# Altium project MAX20801EVBCir_1.PrjPcb
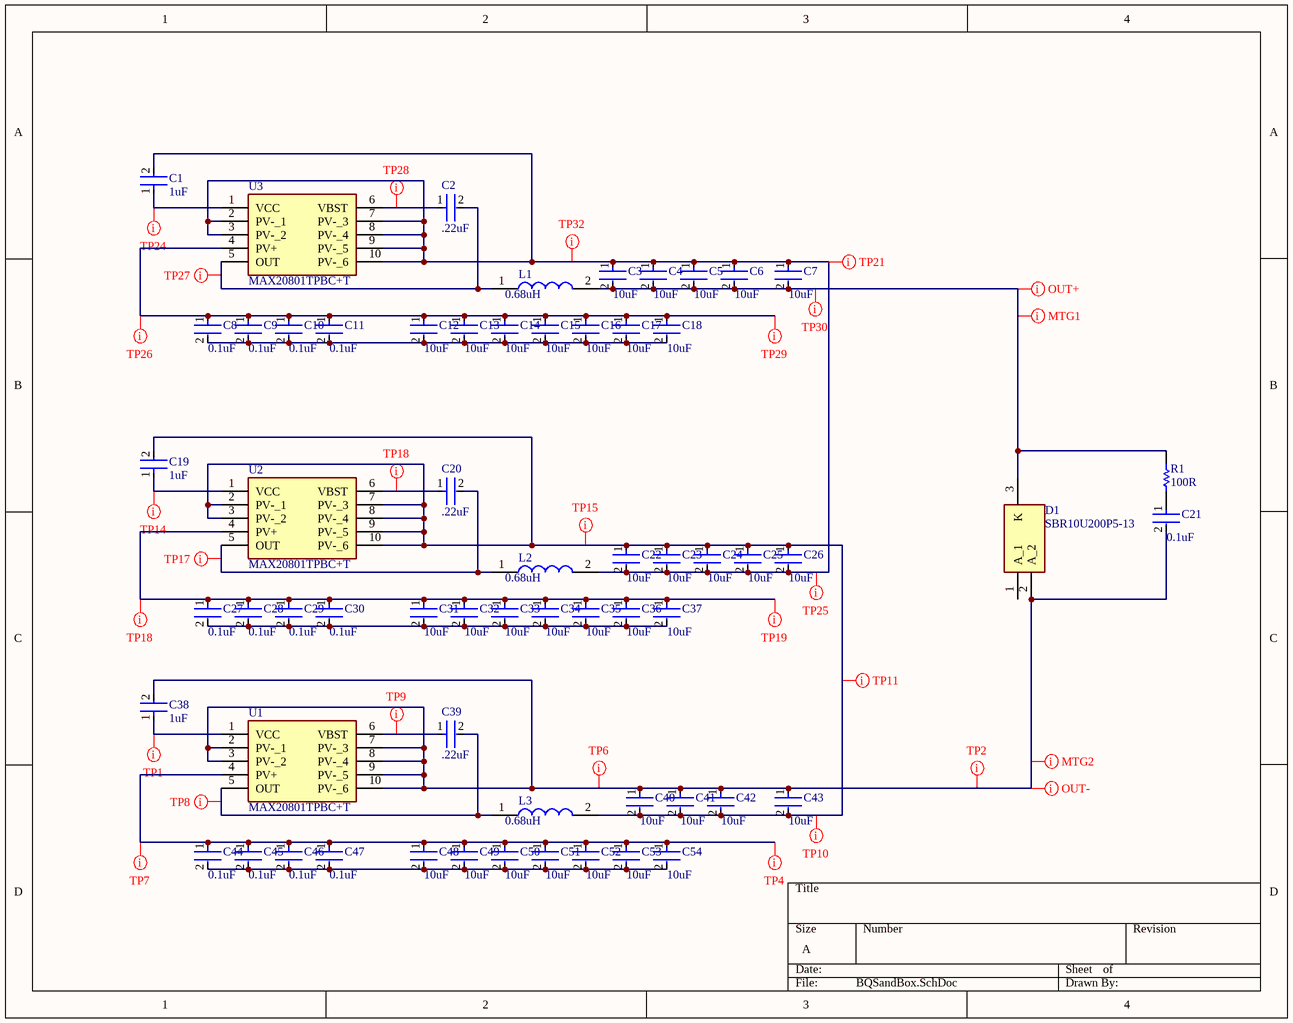
[diagram p0: BQSandBox.SchDoc]
1 sheet, 62 parts. Net scope: global (net labels, ports and power ports of the same name join across sheets).

## Sheet BQSandBox.SchDoc
size A; SheetNumber: 1; SheetTotal: 1

### Parts
C1  1uF  [FP-C0805C-DN-IPC_A]
C2  .22uF  [FP-C0805C-DN-MFG]
C3  10uF  [FP-C0805C-DN-IPC_A]
C4  10uF  [FP-C0805C-DN-IPC_A]
C5  10uF  [FP-C0805C-DN-IPC_A]
C6  10uF  [FP-C0805C-DN-IPC_A]
C7  10uF  [FP-C0805C-DN-IPC_A]
C8  0.1uF  [FP-C0805C-DN-IPC_A]
C9  0.1uF  [FP-C0805C-DN-IPC_A]
C10  0.1uF  [FP-C0805C-DN-IPC_A]
C11  0.1uF  [FP-C0805C-DN-IPC_A]
C12  10uF  [FP-C0805C-DN-IPC_A]
C13  10uF  [FP-C0805C-DN-IPC_A]
C14  10uF  [FP-C0805C-DN-IPC_A]
C15  10uF  [FP-C0805C-DN-IPC_A]
C16  10uF  [FP-C0805C-DN-IPC_A]
C17  10uF  [FP-C0805C-DN-IPC_A]
C18  10uF  [FP-C0805C-DN-IPC_A]
C19  1uF  [FP-C0805C-DN-IPC_A]
C20  .22uF  [FP-C0805C-DN-MFG]
C21  0.1uF  [FP-C0805C-DN-IPC_A]
C22  10uF  [FP-C0805C-DN-IPC_A]
C23  10uF  [FP-C0805C-DN-IPC_A]
C24  10uF  [FP-C0805C-DN-IPC_A]
C25  10uF  [FP-C0805C-DN-IPC_A]
C26  10uF  [FP-C0805C-DN-IPC_A]
C27  0.1uF  [FP-C0805C-DN-IPC_A]
C28  0.1uF  [FP-C0805C-DN-IPC_A]
C29  0.1uF  [FP-C0805C-DN-IPC_A]
C30  0.1uF  [FP-C0805C-DN-IPC_A]
C31  10uF  [FP-C0805C-DN-IPC_A]
C32  10uF  [FP-C0805C-DN-IPC_A]
C33  10uF  [FP-C0805C-DN-IPC_A]
C34  10uF  [FP-C0805C-DN-IPC_A]
C35  10uF  [FP-C0805C-DN-IPC_A]
C36  10uF  [FP-C0805C-DN-IPC_A]
C37  10uF  [FP-C0805C-DN-IPC_A]
C38  1uF  [FP-C0805C-DN-IPC_A]
C39  .22uF  [FP-C0805C-DN-MFG]
C40  10uF  [FP-C0805C-DN-IPC_A]
C41  10uF  [FP-C0805C-DN-IPC_A]
C42  10uF  [FP-C0805C-DN-IPC_A]
C43  10uF  [FP-C0805C-DN-IPC_A]
C44  0.1uF  [FP-C0805C-DN-IPC_A]
C45  0.1uF  [FP-C0805C-DN-IPC_A]
C46  0.1uF  [FP-C0805C-DN-IPC_A]
C47  0.1uF  [FP-C0805C-DN-IPC_A]
C48  10uF  [FP-C0805C-DN-IPC_A]
C49  10uF  [FP-C0805C-DN-IPC_A]
C50  10uF  [FP-C0805C-DN-IPC_A]
C51  10uF  [FP-C0805C-DN-IPC_A]
C52  10uF  [FP-C0805C-DN-IPC_A]
C53  10uF  [FP-C0805C-DN-IPC_A]
C54  10uF  [FP-C0805C-DN-IPC_A]
D1  SBR10U200P5-13  [SBR10U200P513]
L1  0.68uH  [INDPM6965X300N]
L2  0.68uH  [INDPM6965X300N]
L3  0.68uH  [INDPM6965X300N]
R1  100R  [FP-C0805C-DN-IPC_A]
U1  MAX20801TPBC+T  [MAX20801TPBC]
U2  MAX20801TPBC+T  [MAX20801TPBC]
U3  MAX20801TPBC+T  [MAX20801TPBC]

### Nets
NetC1_1: C1.1 U3.1(VCC)
NetC1_2: C1.2 C3.1 C4.1 C5.1 C6.1 C7.1 C22.2 C23.2 C24.2 C25.2 C26.2 L2.2 U3.2(PV-_1) U3.3(PV-_2) U3.7(PV-_3) U3.8(PV-_4) U3.9(PV-_5) U3.10(PV-_6)
NetC2_1: C2.1 U3.6(VBST)
NetC2_2: C2.2 L1.1 U3.5(OUT)
NetC3_2: C3.2 C4.2 C5.2 C6.2 C7.2 D1.3(K) L1.2 R1.2
NetC8_1: C8.1 C9.1 C10.1 C11.1 C12.1 C13.1 C14.1 C15.1 C16.1 C17.1 C18.1 U3.4(PV+)
NetC8_2: C8.2 C9.2 C10.2 C11.2 C12.2 C13.2 C14.2 C15.2 C16.2 C17.2 C18.2
NetC19_1: C19.1 U2.1(VCC)
NetC19_2: C19.2 C22.1 C23.1 C24.1 C25.1 C26.1 C40.2 C41.2 C42.2 C43.2 L3.2 U2.2(PV-_1) U2.3(PV-_2) U2.7(PV-_3) U2.8(PV-_4) U2.9(PV-_5) U2.10(PV-_6)
NetC20_1: C20.1 U2.6(VBST)
NetC20_2: C20.2 L2.1 U2.5(OUT)
NetC21_1: C21.1 R1.1
NetC21_2: C21.2 C38.2 C40.1 C41.1 C42.1 C43.1 D1.2(A_2) U1.2(PV-_1) U1.3(PV-_2) U1.7(PV-_3) U1.8(PV-_4) U1.9(PV-_5) U1.10(PV-_6)
NetC27_1: C27.1 C28.1 C29.1 C30.1 C31.1 C32.1 C33.1 C34.1 C35.1 C36.1 C37.1 U2.4(PV+)
NetC27_2: C27.2 C28.2 C29.2 C30.2 C31.2 C32.2 C33.2 C34.2 C35.2 C36.2 C37.2
NetC38_1: C38.1 U1.1(VCC)
NetC39_1: C39.1 U1.6(VBST)
NetC39_2: C39.2 L3.1 U1.5(OUT)
NetC44_1: C44.1 C45.1 C46.1 C47.1 C48.1 C49.1 C50.1 C51.1 C52.1 C53.1 C54.1 U1.4(PV+)
NetC44_2: C44.2 C45.2 C46.2 C47.2 C48.2 C49.2 C50.2 C51.2 C52.2 C53.2 C54.2

Not connected (* = marked no-connect by the designer): D1 1(A_1)

### Layout directives
mark named TP4: NetC44_1
mark named TP1: NetC38_1
mark named TP8: NetC39_2
mark named TP7: NetC44_1
mark named TP10: NetC19_2
mark named TP11: NetC19_2
mark named TP2: NetC21_2
mark named OUT-: NetC21_2
mark named MTG2: NetC21_2
mark named TP6: NetC21_2
mark named TP9: NetC39_1
mark named TP19: NetC27_1
mark named TP14: NetC19_1
mark named TP17: NetC20_2
mark named TP18: NetC20_1, NetC27_1
mark named TP25: NetC1_2
mark named TP15: NetC19_2
mark named TP29: NetC8_1
mark named TP24: NetC1_1
mark named TP27: NetC2_2
mark named TP26: NetC8_1
mark named TP30: NetC3_2
mark named TP32: NetC1_2
mark named TP28: NetC2_1
mark named OUT+: NetC3_2
mark named MTG1: NetC3_2
mark named TP21: NetC1_2

### Library data of the parts
C1 C19 C38 = C0805C105K4PACTU: Cap Ceramic 1uF 16V X5R 10% SMD 0805 85C Plastic T/R; Manufacturer: KEMET; Dissipation Factor: 5%; Supplier 1: Digi-Key; Manufacturer Part Number: C0805C105K4PACTU; RoHS: Yes; Category: Ceramic Capacitors; Pricing 1: 1=0.20000, 10=0.13400, 50=0.08060, 100=0.06810, 500=0.04662, 1000=0.04124 (USD); Mount: Surface Mount,PCB; Case/Package: 0805; Case Code (Metric): 2012; Case Code (Imperial): 0805; Dielectric Material: Ceramic; Min Operating Temperature: -55°C; Max Operating Temperature: 85°C; Capacitance: 1uF; Tolerance: 10%; Packaging: Tape and Reel; Voltage Rating: 16V; Package Quantity: 1; Voltage Rating (DC): 16V; Dielectric: X5R; Termination: SMD/SMT; Voltage: 16V; Series: C0805C; Construction: Flat; Length: 2mm; Width: 0.049inch; Height: 1.25mm; Thickness: 0.055inch; Depth: 1.25mm; Radiation Hardening: No; REACH SVHC: No SVHC; RoHS Compliant: Yes; Lead Free: Lead Free; ComponentLink1URL: http://www.farnell.com/datasheets/2745930.pdf?src-supplier=Farnell; ComponentLink1Description: http://www.farnell.com/datasheets/2745930.pdf?src-supplier=Farnell; ComponentLink2URL: http://uk.rs-online.com/webdocs/13da/0900766b813daa10.pdf?src-supplier=RSComponents; ComponentLink2Description: http://uk.rs-online.com/webdocs/13da/0900766b813daa10.pdf?src-supplier=RSComponents; ComponentLink3URL: http://components.arrow.com/part/dataview/43037300S8313636N7429?src-supplier=Arrow+Electronics; ComponentLink3Description: http://components.arrow.com/part/dataview/43037300S8313636N7429?src-supplier=Arrow+Electronics; ComponentLink4URL: http://uk.rs-online.com/webdocs/13da/0900766b813daa0f.pdf?src-supplier=RSComponents; ComponentLink4Description: http://uk.rs-online.com/webdocs/13da/0900766b813daa0f.pdf?src-supplier=RSComponents; ComponentLink5URL: https://search.kemet.com/component-edge/download/datasheet/C0805C105K4PAC.pdf?src-supplier=Avnet; ComponentLink5Description: https://search.kemet.com/component-edge/download/datasheet/C0805C105K4PAC.pdf?src-supplier=Avnet; ComponentLink6URL: http://www.farnell.com/datasheets/2745930.pdf?src-supplier=Newark; ComponentLink6Description: http://www.farnell.com/datasheets/2745930.pdf?src-supplier=Newark; ComponentLink7URL: https://search.kemet.com/component-edge/download/datasheet/C0805C105K4PAC.pdf?src-supplier=Allied+Electronics; ComponentLink7Description: https://search.kemet.com/component-edge/download/datasheet/C0805C105K4PAC.pdf?src-supplier=Allied+Electronics; ComponentLink8URL: http://www.farnell.com/datasheets/2745930.pdf?src-supplier=Element14; ComponentLink8Description: http://www.farnell.com/datasheets/2745930.pdf?src-supplier=Element14; ComponentLink9URL: https://www.verical.com/server-webapp/html/getDatasheet?partID=127986&src-supplier=Verical; ComponentLink9Description: https://www.verical.com/server-webapp/html/getDatasheet?partID=127986&src-supplier=Verical; ComponentLink10URL: http://www.farnell.com/datasheets/1824493.pdf?src-supplier=Newark; ComponentLink10Description: http://www.farnell.com/datasheets/1824493.pdf?src-supplier=Newark; ComponentLink11URL: http://www.kemet.com/Lists/ProductCatalog/Attachments/19/KEM_C1006_X5R_SMD.pdf?src-supplier=Avnet; ComponentLink11Description: http://www.kemet.com/Lists/ProductCatalog/Attachments/19/KEM_C1006_X5R_SMD.pdf?src-supplier=Avnet; ComponentLink12URL: https://search.kemet.com/component-edge/download/datasheet/C0805C105K4PAC.pdf?src-supplier=Mouser; ComponentLink12Description: https://search.kemet.com/component-edge/download/datasheet/C0805C105K4PAC.pdf?src-supplier=Mouser; ComponentLink13URL: https://api.kemet.com/component-edge/download/datasheet/C0805C105K4PAC.pdf?src-supplier=Digi-Key; ComponentLink13Description: https://api.kemet.com/component-edge/download/datasheet/C0805C105K4PAC.pdf?src-supplier=Digi-Key; ComponentLink14URL: https://search.kemet.com/component-edge/download/datasheet/C0805C105K4PAC.pdf?src-supplier=TTI; ComponentLink14Description: https://search.kemet.com/component-edge/download/datasheet/C0805C105K4PAC.pdf?src-supplier=TTI; Supplier Part Number 1: 399-C0805C105K4PAC7800CT-ND; Stock 1: 112717
C2 C20 C39 = CMP-1036-04552-2: CAP CER 0.22UF 50V X7R 0805; Manufacturer: KEMET; Manufacturer Part Number: C0805C224K5RACTU; Value: 0.22 μF; Description: C0805 0.22 μF X7R 30ppm/°C 10.00% 50 V; Temperature Coefficient: 30ppm/°C; Material: Ceramic; Tolerance: 0.1; ComponentLink2URL: https://content.kemet.com/datasheets/KEM_C1003_C0G_SMD.pdf; Temperature Characteristic: X7R; Device Class L3: Ceramic Capacitors; Lead Free: Yes; Temperature: -55°C to +125°C; RoHS: TRUE; Capacitance: 0.22 μF; Automotive: No; Octopart: https://octopart.com/c0805c224k5ractu-kemet-144670; Temperature Range Low: -55°C; Height: 0.88mm; Device Class L1: Passive Components; Digikey Description: CAP CER 0.22UF 50V X7R 0805; ComponentLink2Description: Datasheet; Mouser Description: CAP CER 0.22UF 50V X7R 0805; Category: Cap; Ipc Land Pattern Name: CAPC200125X78; Temperature Range High: +125°C; Package: C0805C-DN; Device Class L2: Capacitors; Voltage Rating: 50 V
C3-C7 C12-C18 C22-C26 C31-C37 C40-C43 C48-C54 = GRM21BR61C106KE15L: 贴片电容（MLCC） 10μF ±10% 16V X5R 0805; Manufacturer: Murata; Material: Ceramic; Supplier 1: Digi-Key; Manufacturer Part Number: GRM21BR61C106KE15L; RoHS: Yes; Category: Ceramic Capacitors; Pricing 1: 1=0.18000, 10=0.12400, 50=0.07420, 100=0.06270, 500=0.04292, 1000=0.03798 (USD); Mount: Surface Mount; Case/Package: 0805; Case Code (Imperial): 0805; Case Code (Metric): 2012; Min Operating Temperature: -55°C; Max Operating Temperature: 85°C; Packaging: Tape and Reel; Capacitance: 10uF; Tolerance: 10%; Voltage Rating: 16V; Voltage Rating (DC): 16V; Package Quantity: 1; Dielectric: X5R; Termination: SMD/SMT; Voltage: 16V; Series: GRM; Construction: Flat; Length: 2mm; Width: 1.25mm; Height: 1.25mm; Thickness: 0.053inch; Depth: 1.25mm; Radiation Hardening: No; REACH SVHC: No SVHC; RoHS Compliant: Yes; Lead Free: Lead Free; ComponentLink1URL: https://datasheet.ciiva.com/7719/1747468-7719090.pdf?src-supplier=Element14; ComponentLink1Description: https://datasheet.ciiva.com/7719/1747468-7719090.pdf?src-supplier=Element14; ComponentLink2URL: https://datasheet.ciiva.com/23628/460993-23628598.pdf?src-supplier=Newark; ComponentLink2Description: https://datasheet.ciiva.com/23628/460993-23628598.pdf?src-supplier=Newark; ComponentLink3URL: https://datasheet.ciiva.com/2989/product-2989696.pdf?src-supplier=Avnet; ComponentLink3Description: https://datasheet.ciiva.com/2989/product-2989696.pdf?src-supplier=Avnet; ComponentLink4URL: https://datasheet.ciiva.com/3777/1956grm21br61c106ke1523-3777137.pdf?src-supplier=Arrow+Electronics; ComponentLink4Description: https://datasheet.ciiva.com/3777/1956grm21br61c106ke1523-3777137.pdf?src-supplier=Arrow+Electronics; ComponentLink5URL: https://datasheet.ciiva.com/29202/450891-da-01-de-vs-chip-kond-0805-10-0-uf-10pr-16-0v-x5r-29202696.pdf?src-supplier=Conrad; ComponentLink5Description: https://datasheet.ciiva.com/29202/450891-da-01-de-vs-chip-kond-0805-10-0-uf-10pr-16-0v-x5r-29202696.pdf?src-supplier=Conrad; ComponentLink6URL: https://datasheet.ciiva.com/29199/454607-da-01-en-vs-kondensator-0805-29199611.pdf?src-supplier=Conrad; ComponentLink6Description: https://datasheet.ciiva.com/29199/454607-da-01-en-vs-kondensator-0805-29199611.pdf?src-supplier=Conrad; ComponentLink7URL: https://datasheet.ciiva.com/137/partnumbering-e-01-137918.pdf?src-supplier=Digi-Key; ComponentLink7Description: https://datasheet.ciiva.com/137/partnumbering-e-01-137918.pdf?src-supplier=Digi-Key; ComponentLink8URL: https://datasheet.ciiva.com/137/partnumbering-e-01-137917.pdf?src-supplier=Digi-Key; ComponentLink8Description: https://datasheet.ciiva.com/137/partnumbering-e-01-137917.pdf?src-supplier=Digi-Key; ComponentLink9URL: https://datasheet.ciiva.com/137/partnumbering-e-01-137919.pdf?src-supplier=Digi-Key; ComponentLink9Description: https://datasheet.ciiva.com/137/partnumbering-e-01-137919.pdf?src-supplier=Digi-Key; ComponentLink10URL: https://datasheet.ciiva.com/2989/product-2989697.pdf?src-supplier=Avnet; ComponentLink10Description: https://datasheet.ciiva.com/2989/product-2989697.pdf?src-supplier=Avnet; Supplier Part Number 1: 490-3886-1-ND; Stock 1: 9508002
C8-C11 C21 C27-C30 C44-C47 = C0805C104K5RACTU: Cap Ceramic 0.1uF 50V X7R 10% SMD 2.0 x 1.2 mm 125 C Paper T/R; Manufacturer: KEMET; Capacitance: 100nF; Voltage: 500V; Supplier 1: Digi-Key; Manufacturer Part Number: C0805C104K5RACTU; RoHS: Yes; Category: Ceramic Capacitors; Pricing 1: 1=0.15000, 10=0.10500, 50=0.05960, 100=0.04940, 500=0.03466, 1000=0.02869 (USD); Mount: Surface Mount,PCB; Case/Package: 0805; Number of Pins: 2; Case Code (Imperial): 0805; Case Code (Metric): 2012; Dielectric Material: Ceramic; Contact Plating: Tin,Matte; Min Operating Temperature: -55°C; Max Operating Temperature: 125°C; Package Quantity: 4000; Voltage Rating: 50V; Tolerance: 10%; Packaging: Tape and Reel; Dielectric: X7R; Termination: SMD/SMT; Voltage Rating (DC): 50V; Series: C0805C; Construction: Flat; Length: 2mm; Width: 1.2mm; Height: 0.9mm; Thickness: 0.035inch; Depth: 1.25mm; Lead Pitch: 0.75mm; Radiation Hardening: No; REACH SVHC: No SVHC; RoHS Compliant: Yes; ComponentLink1URL: https://www.distrelec.biz/Web/Downloads/_t/ds/KEM_C1002_X7R_SMD_eng_tds.pdf?mime=application%2Fpdf&src-supplier=Distrelec; ComponentLink1Description: https://www.distrelec.biz/Web/Downloads/_t/ds/KEM_C1002_X7R_SMD_eng_tds.pdf?mime=application%2Fpdf&src-supplier=Distrelec; ComponentLink2URL: http://www.farnell.com/datasheets/2740684.pdf?src-supplier=Farnell; ComponentLink2Description: http://www.farnell.com/datasheets/2740684.pdf?src-supplier=Farnell; ComponentLink3URL: http://www.farnell.com/datasheets/2740684.pdf?src-supplier=Element14; ComponentLink3Description: http://www.farnell.com/datasheets/2740684.pdf?src-supplier=Element14; Supplier Part Number 1: 399-C0805C104K5RAC7800CT-ND; Stock 1: 2034176
D1 = SBR10U200P5-13: Diode; Manufacturer_Name: Diodes Inc.; Datasheet Link: https://www.diodes.com/assets/Datasheets/SBR10U200P5.pdf; Height: 1.15mm; Manufacturer_Part_Number: SBR10U200P5-13
L1-L3 = IHLP2525CZERR47M01: Inductor; Manufacturer_Name: Vishay; Datasheet Link: https://componentsearchengine.com/Datasheets/2/IHLP2525CZERR47M01.pdf; Height: 3mm; Manufacturer_Part_Number: IHLP2525CZERR47M01; Mouser Part Number: 70-IHLP2525CZERR47M1; Mouser Price/Stock: https://www.mouser.co.uk/ProductDetail/Vishay-Dale/IHLP2525CZERR47M01?qs=%2F2dL3%2Fmkwc7l69kmHwb0VQ%3D%3D; Arrow Part Number: IHLP2525CZERR47M01; Arrow Price/Stock: https://www.arrow.com/en/products/ihlp2525czerr47m01/vishay?region=nac
R1 = ERJ-6ENF1000V: 贴片电阻 100Ω ±1% 1/8W ±100ppm/℃ 0805; Manufacturer: Panasonic; Temperature Coefficient: 100ppm/°C; Max Power Dissipation: 125mW; Voltage Rating: 150V; Supplier 1: Digi-Key; Manufacturer Part Number: ERJ-6ENF1000V; RoHS: Yes; Category: Chip SMD Resistors; Mount: Surface Mount; Case/Package: 0805; Number of Pins: 2; Case Code (Imperial): 0805; Case Code (Metric): 2012; Contact Plating: Tin; Size Code: 0805; Min Operating Temperature: -55°C; Max Operating Temperature: 155°C; Packaging: Tape and Reel; Resistance: 100R; Tolerance: 1%; Resistor Type: Thick Film; Number of Terminations: 2; Series: ERJ; Package Quantity: 1; Features: Automotive AEC-Q200; Termination: SMD/SMT; Construction: Rectangular; Power Rating: 125mW; Voltage Rating (DC): 150V; Resistance Tolerance: 1%; Technology: THICK FILM; Length: 2mm; Width: 1.2mm; Height: 0.6mm; Depth: 1.25mm; Radiation Hardening: No; RoHS Compliant: Yes; Military Standard: Not; Lead Free: Lead Free; REACH SVHC: No SVHC; ComponentLink1URL: https://datasheet.ciiva.com/11808/0900766b80f80784-11808206.pdf?src-supplier=RSComponents; ComponentLink1Description: https://datasheet.ciiva.com/11808/0900766b80f80784-11808206.pdf?src-supplier=RSComponents; ComponentLink2URL: https://datasheet.ciiva.com/7830/426256-7830744.pdf?src-supplier=Element14; ComponentLink2Description: https://datasheet.ciiva.com/7830/426256-7830744.pdf?src-supplier=Element14; ComponentLink3URL: https://datasheet.ciiva.com/7830/1678782-7830986.pdf?src-supplier=Element14; ComponentLink3Description: https://datasheet.ciiva.com/7830/1678782-7830986.pdf?src-supplier=Element14; ComponentLink4URL: https://datasheet.ciiva.com/46419/1678782-46419878.pdf?src-supplier=Element14; ComponentLink4Description: https://datasheet.ciiva.com/46419/1678782-46419878.pdf?src-supplier=Element14; ComponentLink5URL: https://datasheet.ciiva.com/16765/70260748-16765594.pdf?src-supplier=Allied+Electronics; ComponentLink5Description: https://datasheet.ciiva.com/16765/70260748-16765594.pdf?src-supplier=Allied+Electronics; ComponentLink6URL: https://datasheet.ciiva.com/9186/aoa0000ce2-9186686.pdf?src-supplier=Avnet; ComponentLink6Description: https://datasheet.ciiva.com/9186/aoa0000ce2-9186686.pdf?src-supplier=Avnet; ComponentLink7URL: https://datasheet.ciiva.com/30154/aoa0000ce2-30154938.pdf?src-supplier=Onlinecomponents.com; ComponentLink7Description: https://datasheet.ciiva.com/30154/aoa0000ce2-30154938.pdf?src-supplier=Onlinecomponents.com; Supplier Part Number 1: P100CCT-ND
U1-U3 = MAX20801TPBC+T: Integrated Circuit; Manufacturer_Name: Maxim Integrated; Datasheet Link: https://pdfserv.maximintegrated.com/en/ds/MAX20801.pdf; Height: 1mm; Manufacturer_Part_Number: MAX20801TPBC+T